# EAGLE design asserv (EAGLE 8.6.3)
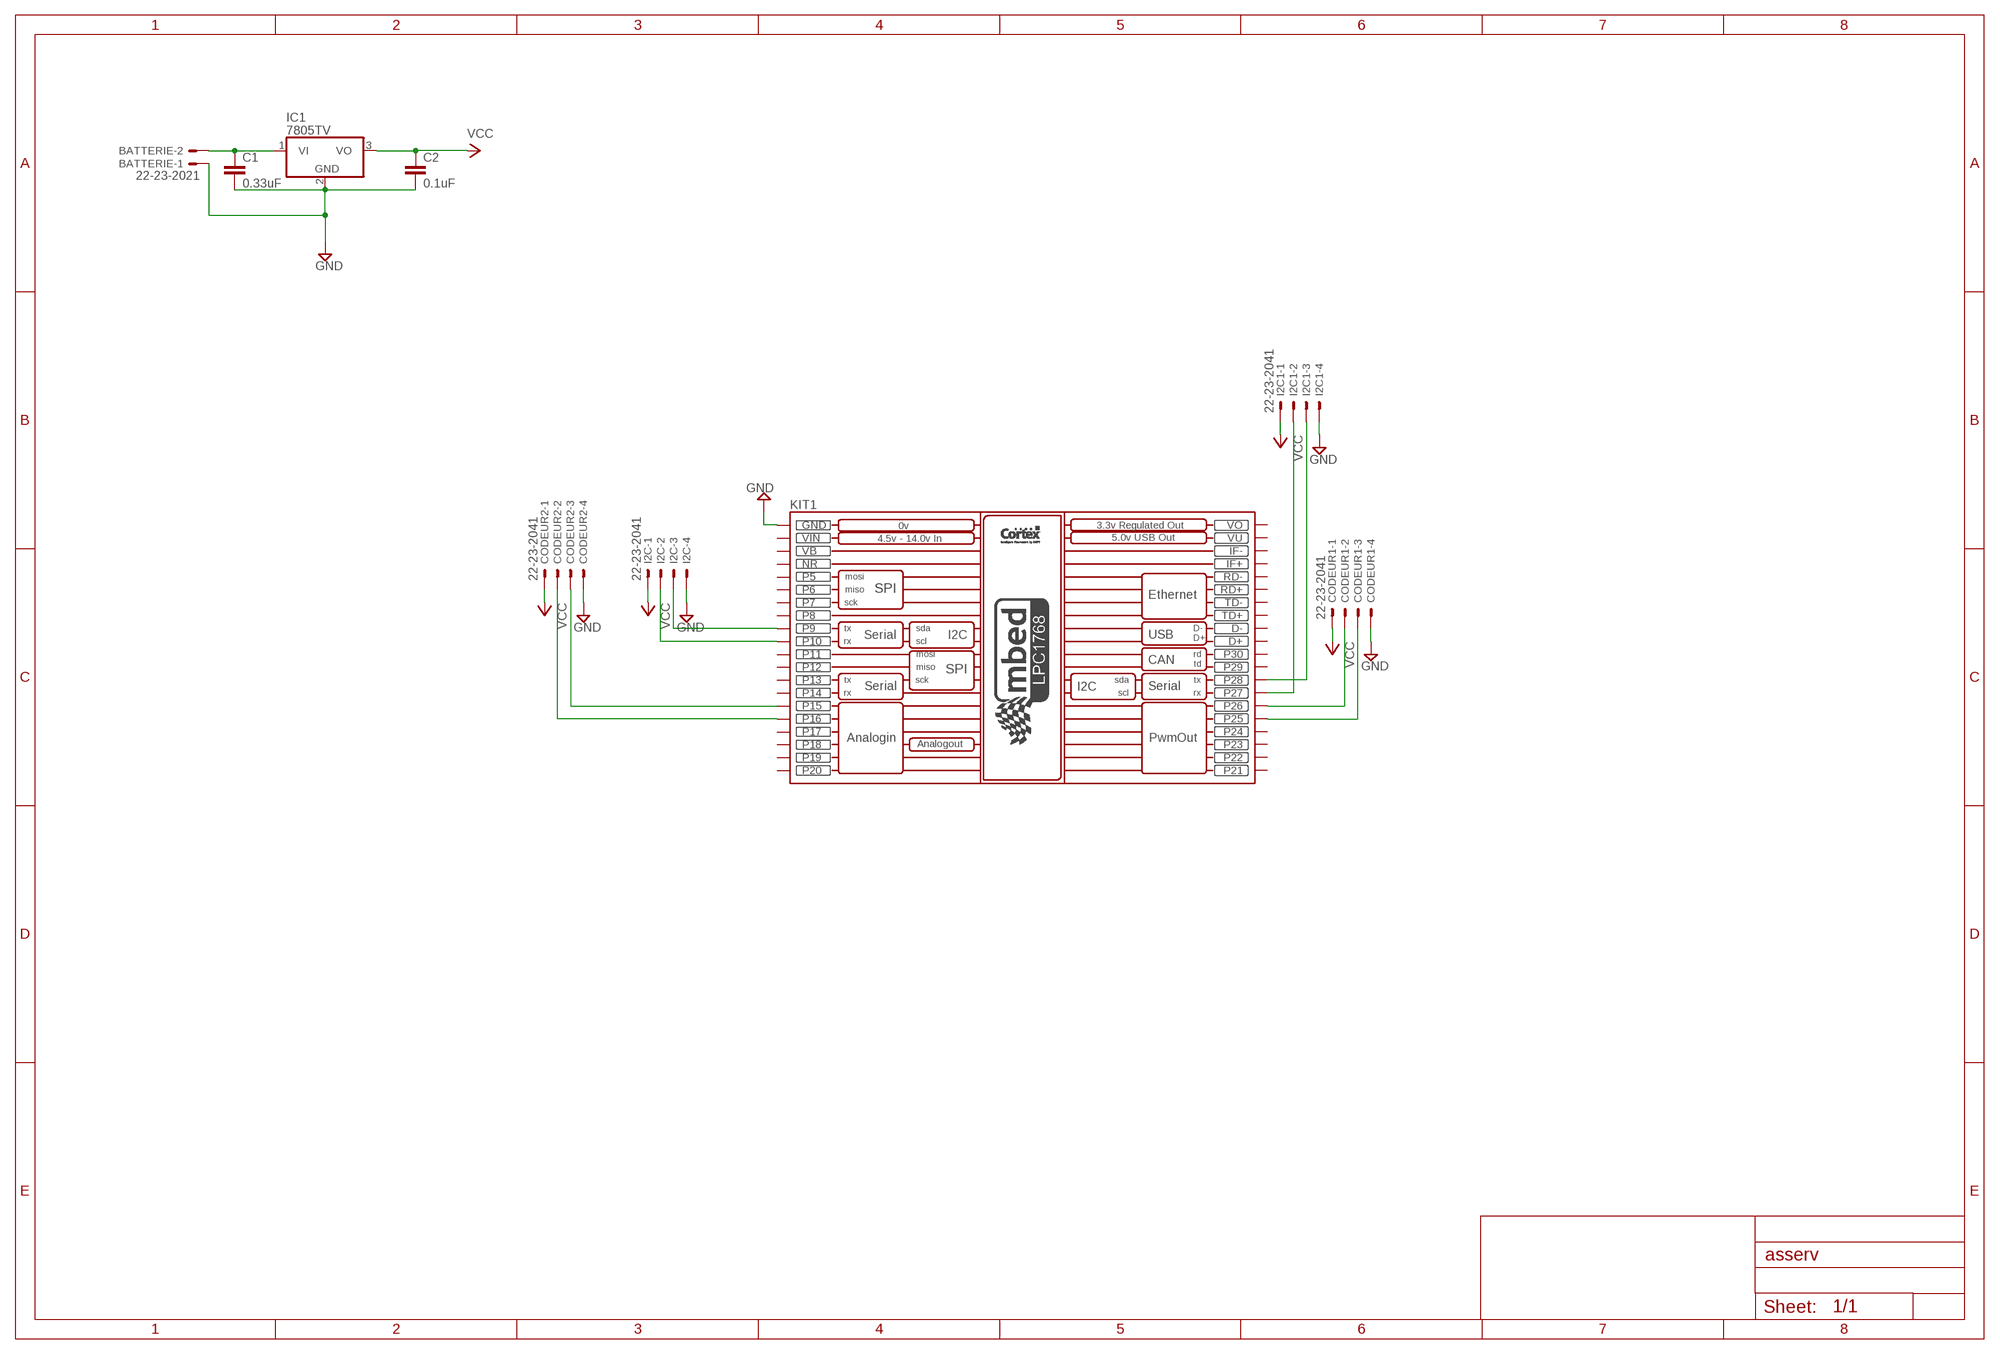
[diagram p0: schematic, sheet 1]

## Parts
BATTERIE  22-23-2021  [22-23-2021]
C1  0.33uF  C5/2.5  [C5B2.5]
C2  0.1uF  C5/2.5  [C5B2.5]
CODEUR1  22-23-2041  [22-23-2041]
CODEUR2  22-23-2041  [22-23-2041]
I2C  22-23-2041  [22-23-2041]
I2C1  22-23-2041  [22-23-2041]
IC1  7805TV  [TO220V]
KIT1  MBED_NXP_LPC1768  [MBED-KIT]

## Nets
GND: BATTERIE.1 C1.2 C2.2 CODEUR1.4 CODEUR2.4 I2C1.4 I2C.4 IC1.2(GND) KIT1.GND
N$1: BATTERIE.2 C1.1 IC1.1(VI)
N$2: I2C1.2 KIT1.P$27(P27)
N$3: I2C1.3 KIT1.P$28(P28)
N$5: CODEUR2.3 KIT1.P$15(P15)
N$6: CODEUR2.2 KIT1.P$16(P16)
N$7: I2C.3 KIT1.P$9(P9)
N$8: I2C.2 KIT1.P$10(P10)
N$9: CODEUR1.3 KIT1.P$25(P25)
N$10: CODEUR1.2 KIT1.P$26(P26)
VCC: C2.1 CODEUR1.1 CODEUR2.1 I2C1.1 I2C.1 IC1.3(VO)
Unconnected: KIT1.D+ KIT1.D- KIT1.IF+ KIT1.IF- KIT1.P$5(P5) KIT1.P$6(P6) KIT1.P$7(P7) KIT1.P$8(P8) KIT1.P$11(P11) KIT1.P$12(P12) KIT1.P$13(P13) KIT1.P$14(P14) KIT1.P$17(P17) KIT1.P$18(P18) KIT1.P$19(P19) KIT1.P$20(P20) KIT1.P$21(P21) KIT1.P$22(P22) KIT1.P$23(P23) KIT1.P$24(P24) KIT1.P$29(P29) KIT1.P$30(P30) KIT1.RD+ KIT1.RD- KIT1.TD+ KIT1.TD-

## Power pins joined to a net without a drawn wire
NR: KIT1.NR
VB: KIT1.VB
VIN: KIT1.VIN
VO: KIT1.VOUT(VO)
VU: KIT1.VU

## Library data of the parts
BATTERIE = con-molex:22-23-2021: .100" (2.54mm) Center Header - 2 Pin; MF: MOLEX; MPN: 22-23-2021; OC_FARNELL: 1462926; OC_NEWARK: 25C3832
C1 C2 = capacitor-wima:C: CAPACITOR naming: grid - package width
CODEUR1 CODEUR2 I2C I2C1 = con-molex:22-23-2041: .100" (2.54mm) Center Header - 4 Pin; MF: MOLEX; MPN: 22-23-2041; OC_FARNELL: 1462920; OC_NEWARK: 38C0355
IC1 = linear:78*: Positive VOLTAGE REGULATOR Source: http://cache.national.com/ds/LM/LM78L05.pdf http://www.fairchildsemi.com/ds/LM/LM7805.pdf
KIT1 = MBED_v2.1:MBED_NXP_LPC1768: Mbed LPC1768 - ARM CORTEX v2.1 * Schematic symbol is now placed in eagles's default raster. *The pads diameter are suitable for routing between mbed pins * mbed pads are 0.8 mm drill diameter. --------------------------------------------- Created by: Mohamed Yousry *Alexandria, Egypt *Email: mohamed.yousry@ieeegoldegypt.org

## Board
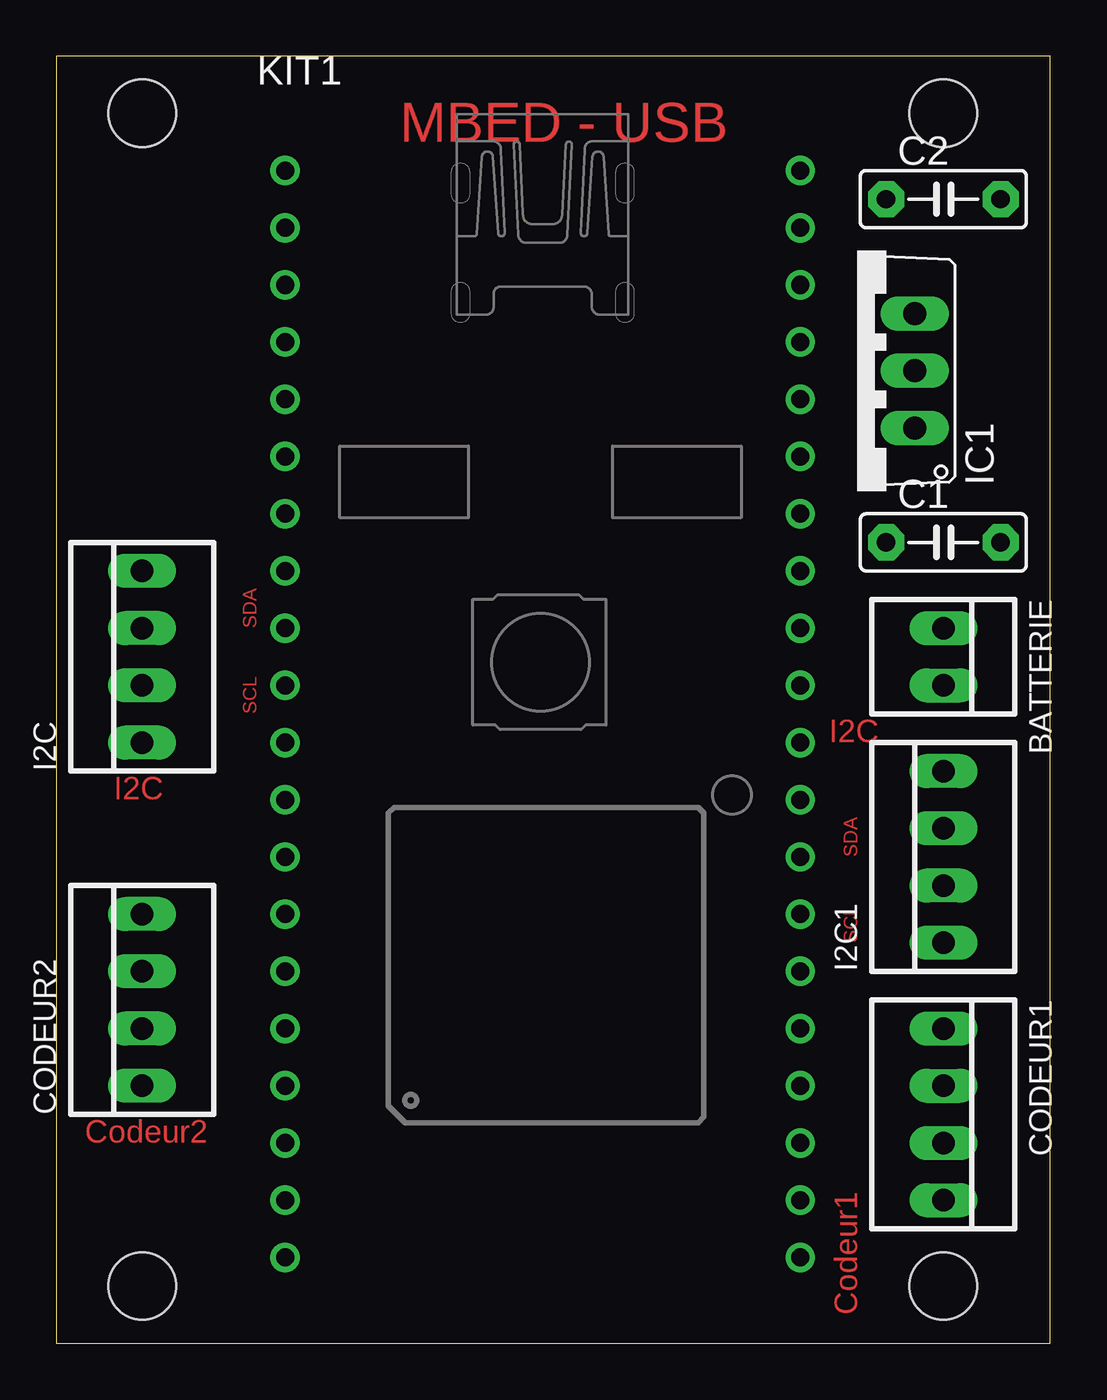
[diagram p1: board, top side]
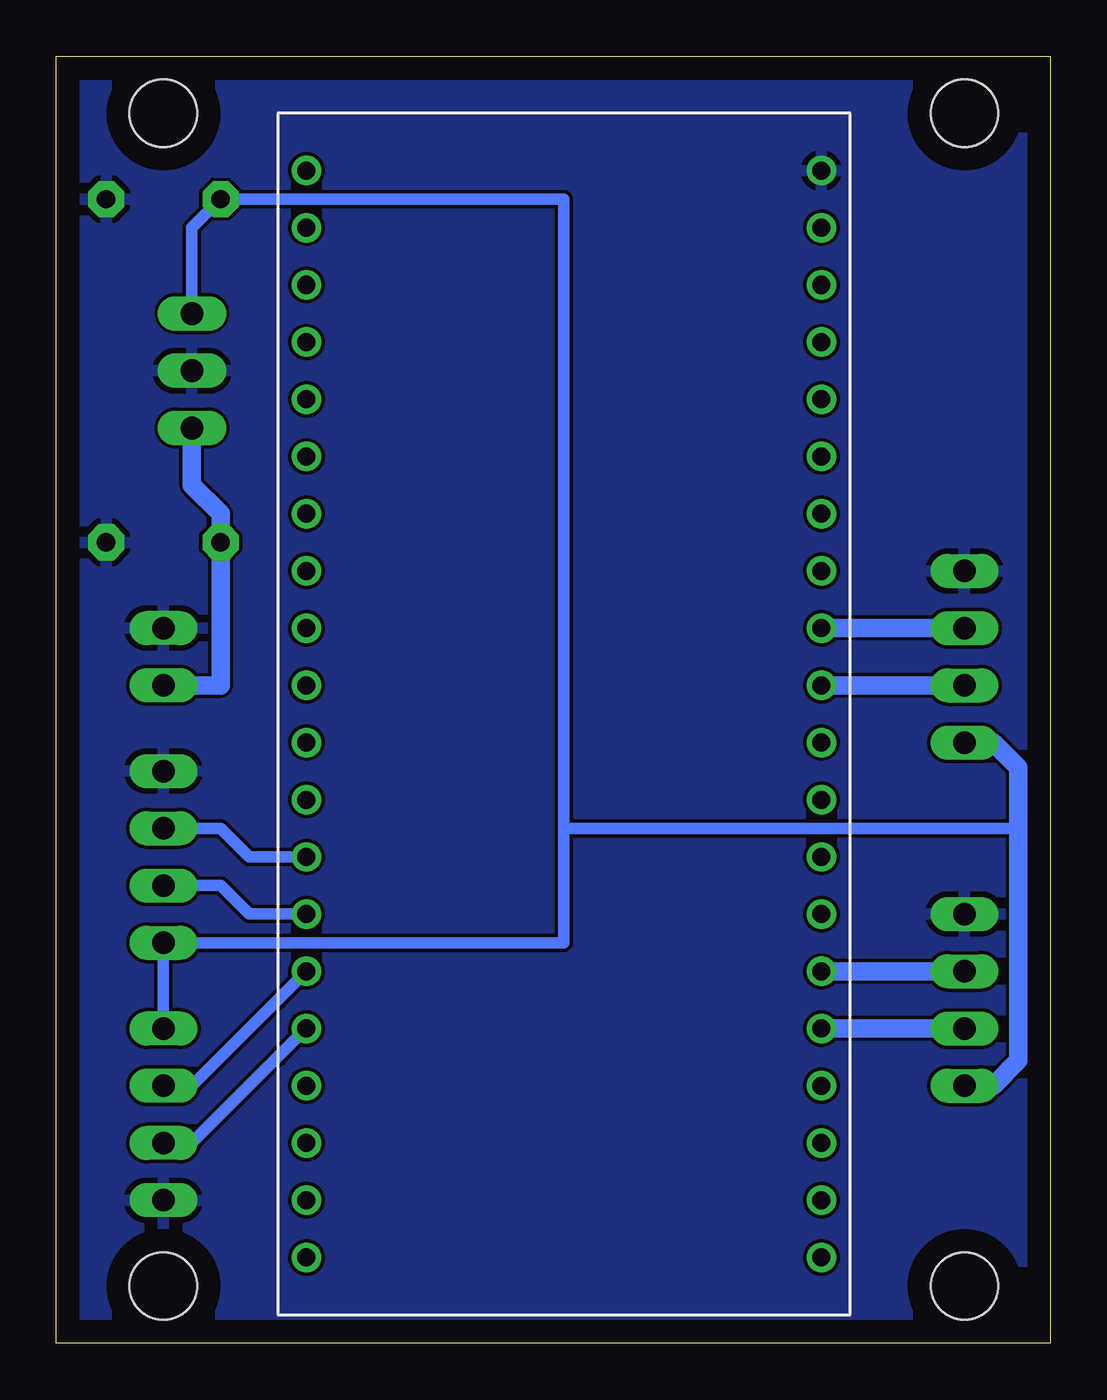
[diagram p2: board, bottom side, seen from below]

Size 44.12 x 57.14 mm. Coordinates in mm from the lower left corner, seen from the top.
Outline: 0,0 44.12,0 44.12,57.14 0,57.14 0,0
Copper layers (1*16): Top 0.035mm / dielectric 1.5mm / Bottom 0.035mm
Design rules "default": minimum track width 6mil, minimum drill 0.35mm, track to track 6mil, track to pad 6mil, pad to pad 6mil, via to via 6mil, smd to smd 6mil, copper to edge 40mil, drill to drill 6mil, minimum pad ring 10mil, minimum via ring 8mil, stop-mask expansion 4mil, vias tented up to drill 0mil, thermal gap 10mil
Holes 3 mm at 39.37,54.61 3.81,54.61 3.81,2.54 39.37,2.54

### Footprints (pad centres in the part's own frame; a part is rotated, then mirrored left to right if it is on the bottom)
22-23-2021 = drill 1 long: 1 -1.27,0; 2 1.27,0
C5B2.5 = drill 0.813 pad 1.6 octagon: 1 -2.54,0; 2 2.54,0
22-23-2041 = drill 1 long: 1 -3.81,0; 2 -1.27,0; 3 1.27,0; 4 3.81,0
TO220V = drill 1.016 long: 1 -2.54,-2.54; 2 0,-2.54; 3 2.54,-2.54
MBED-KIT = drill 0.8: D+ 11.43,1.27; D- 11.43,3.81; GND -11.43,24.13; IF+ 11.43,16.51; IF- 11.43,19.05; NR -11.43,16.51; P$5 -11.43,13.97; P$6 -11.43,11.43; P$7 -11.43,8.89; P$8 -11.43,6.35; P$9 -11.43,3.81; P$10 -11.43,1.27; P$11 -11.43,-1.27; P$12 -11.43,-3.81; P$13 -11.43,-6.35; P$14 -11.43,-8.89; P$15 -11.43,-11.43; P$16 -11.43,-13.97; P$17 -11.43,-16.51; P$18 -11.43,-19.05; P$19 -11.43,-21.59; P$20 -11.43,-24.13; P$21 11.43,-24.13; P$22 11.43,-21.59; P$23 11.43,-19.05; P$24 11.43,-16.51; P$25 11.43,-13.97; P$26 11.43,-11.43; P$27 11.43,-8.89; P$28 11.43,-6.35; P$29 11.43,-3.81; P$30 11.43,-1.27; RD+ 11.43,11.43; RD- 11.43,13.97; TD+ 11.43,6.35; TD- 11.43,8.89; VB -11.43,19.05; VIN -11.43,21.59; VOUT 11.43,24.13; VU 11.43,21.59

### Placement (x,y rotation side)
BATTERIE  39.37,30.48 270 top
C1  39.37,35.56 0 top
C2  39.37,50.8 0 top
CODEUR1  39.37,10.16 270 top
CODEUR2  3.81,15.24 90 top
I2C  3.81,30.48 90 top
I2C1  39.37,21.59 90 top
IC1  35.56,43.18 90 top
KIT1  21.59,27.94 0 top

### Tracks (layer width: path | path; a pad name or v marks a point on that pad's centre or on a via)
GND
  pour Bottom: 0,0 0,55.88 43.18,55.88 43.18,0
N$1
  Bottom 0.813: BATTERIE.2 36.83,29.21 C1.1 36.83,36.83 38.1,38.1 IC1.1
N$2
  Bottom 0.508: I2C1.2 36.83,20.32 35.56,19.05 KIT1.P$27
N$3
  Bottom 0.508: I2C1.3 36.83,22.86 35.56,21.59 KIT1.P$28
N$5
  Bottom 0.813: CODEUR2.3 KIT1.P$15
N$6
  Bottom 0.813: CODEUR2.2 KIT1.P$16
N$7
  Bottom 0.813: I2C.3 KIT1.P$9
N$8
  Bottom 0.813: I2C.2 KIT1.P$10
N$9
  Bottom 0.508: CODEUR1.3 38.1,8.89 KIT1.P$25
N$10
  Bottom 0.508: CODEUR1.2 38.1,11.43 KIT1.P$26
VCC
  Bottom 0.508: CODEUR1.1 I2C1.1 21.59,17.78 21.59,22.86 | IC1.3 38.1,49.53 C2.1 21.59,50.8 21.59,22.86 | 21.59,22.86 1.42,22.86
  Bottom 0.813: CODEUR2.1 2.54,11.43 1.42,12.55 1.42,22.86 1.42,25.55 2.54,26.67 I2C.1

### Text on the board
Top: MBED - USB | SDA | SCL | I2C | I2C | SDA | SCL | Codeur2 | Codeur1